# EasyEDA schematic SCH - RC2014- Dev V1.1 - freeroute.json

## Sheets
1 SCH - RC2014 - Teletext Dev V1.0: TITLE: ZX TTX2000 DEVELOPMENT BOARD - CPLD; REV: V1.0; Date: 07-09-2024; Sheet: 1/2
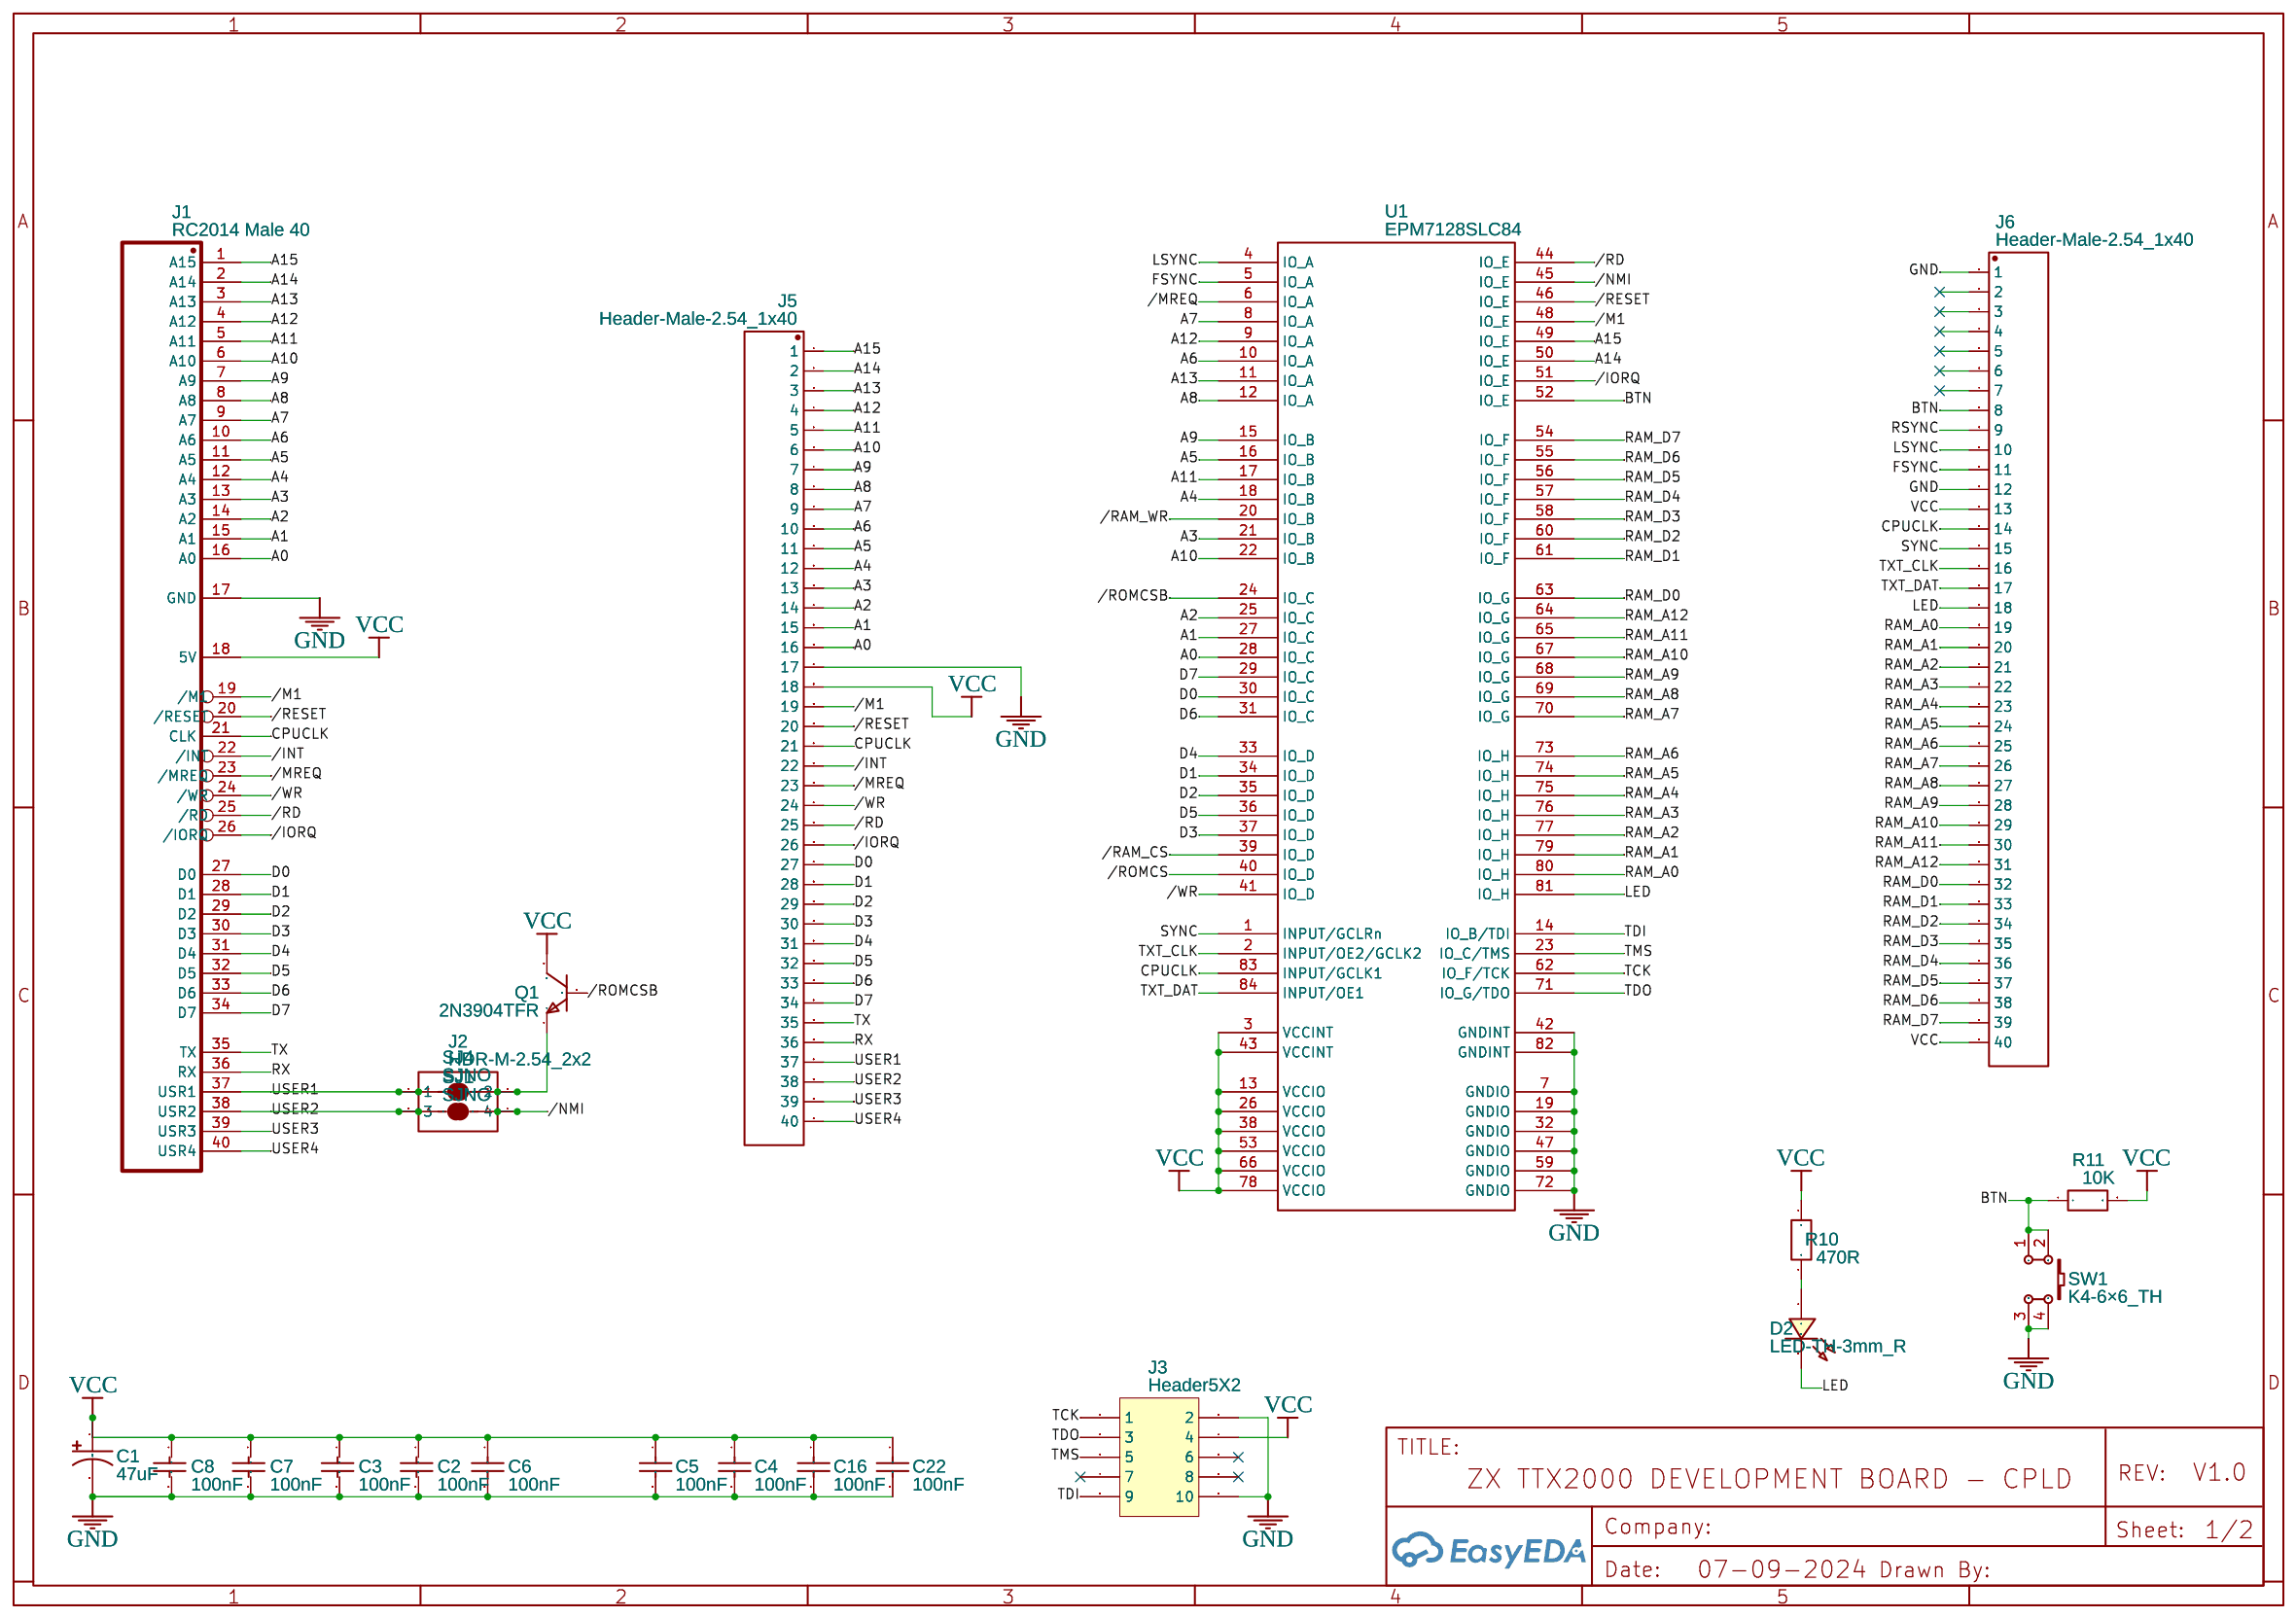
[diagram p0: SCH - RC2014 - Teletext Dev V1.0]
2 SCH - ROM & RAM: Sheet: 2/2
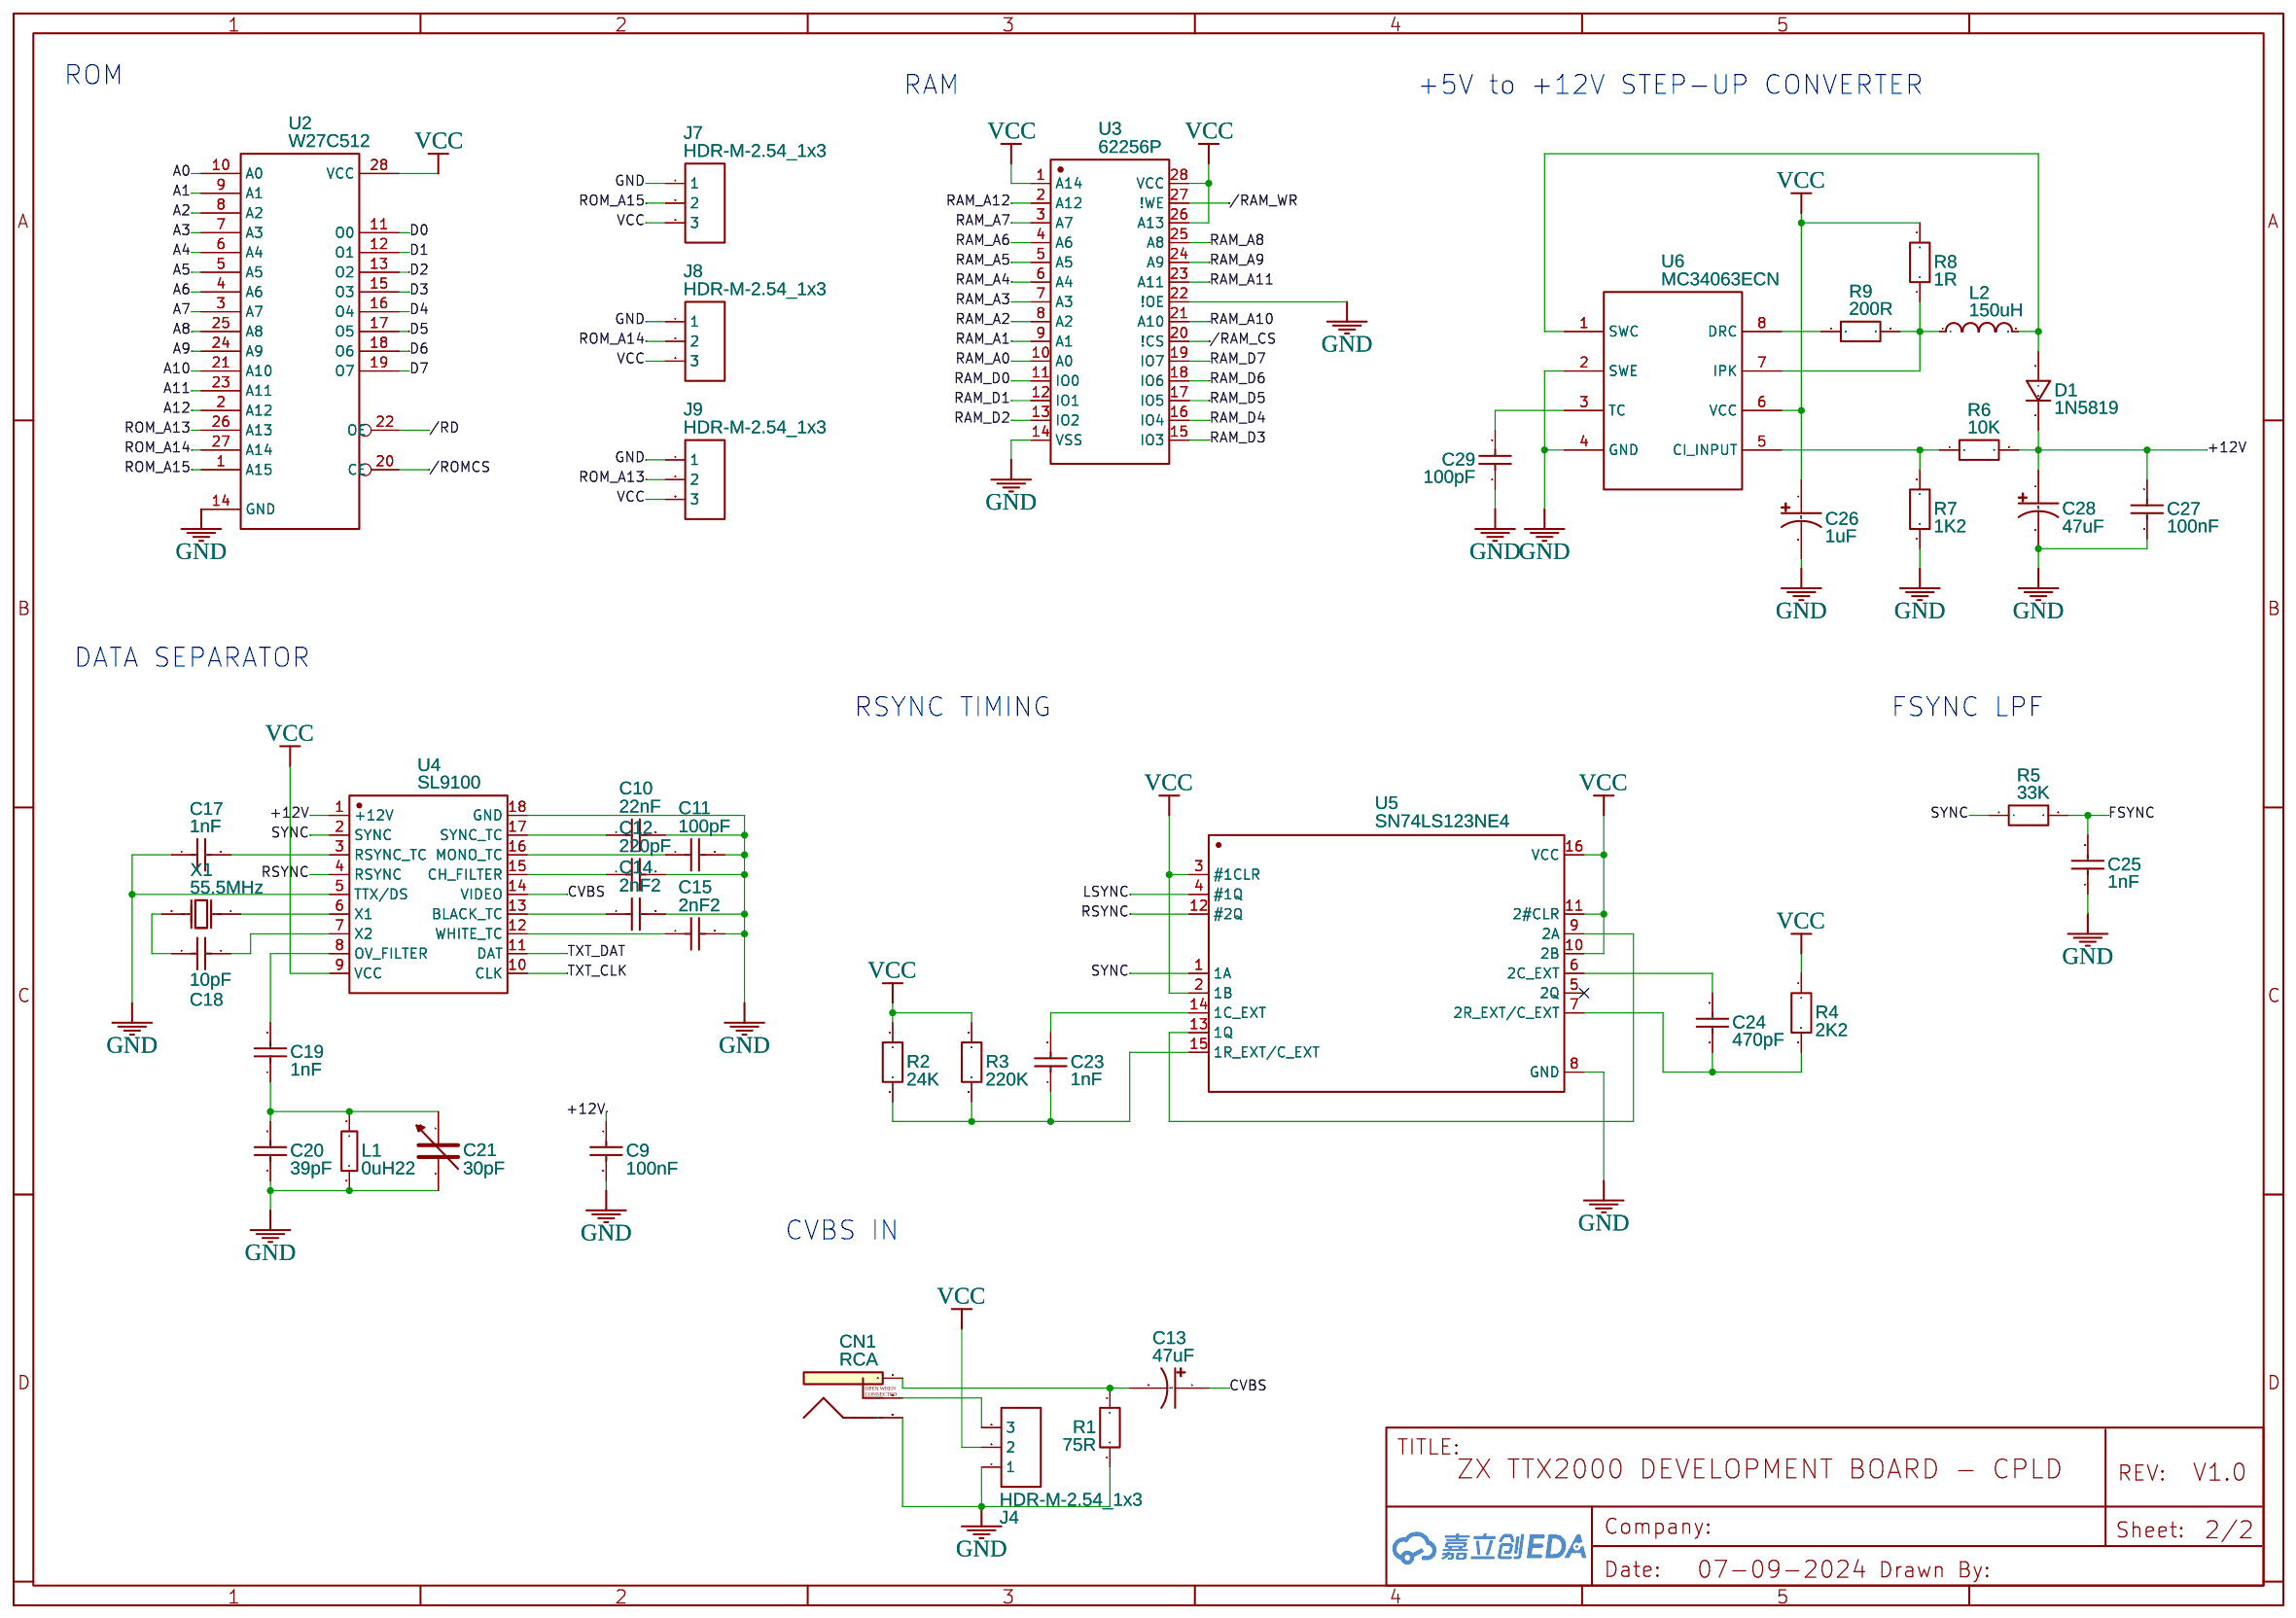
[diagram p1: SCH - ROM & RAM]
3 Fixes: TITLE: Fixes to be incorporated in V1.1; REV: 1.0; Date: 2024-10-29; Sheet: 1/1
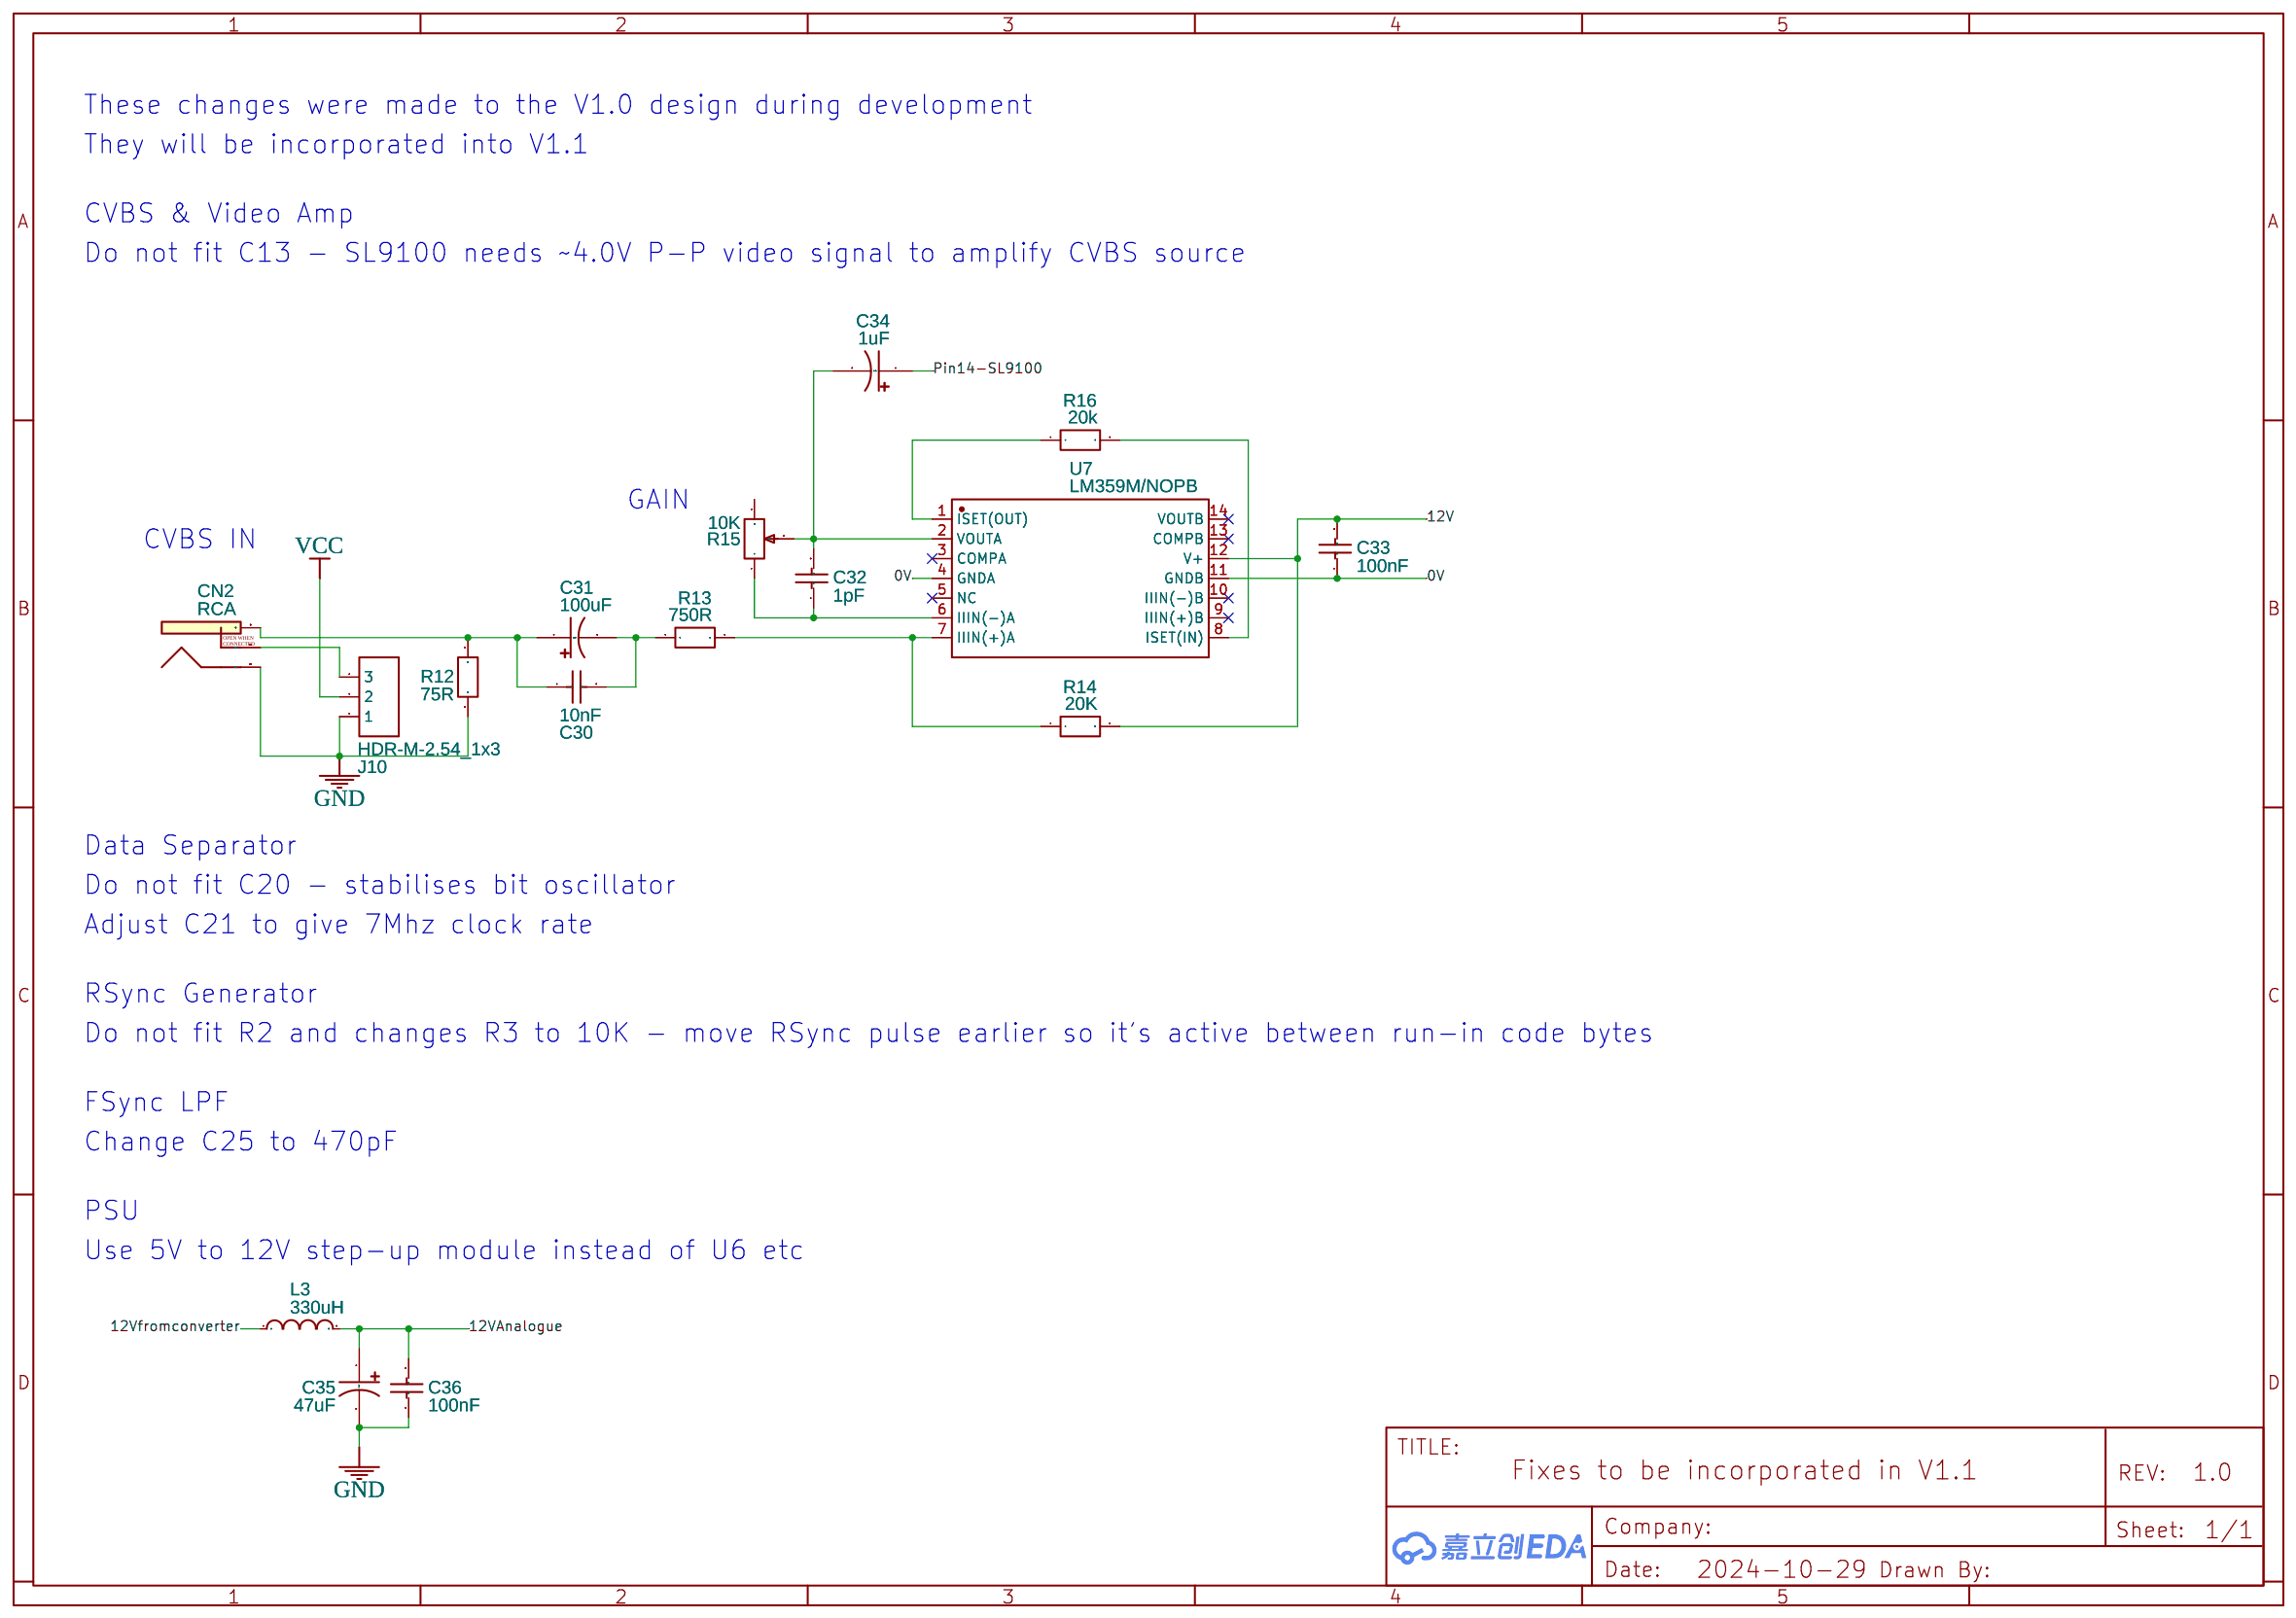
[diagram p2: Fixes]

## Parts
sheet Fixes
C30  10nF  [CAP-TH_L5.5-W3.5-P2.50-D0.5 COPY]
C31  100uF  [CAP-TH_BD6.3-P2.50-D1.0-FD]
C32  1pF  [CAP-TH_L5.5-W3.5-P2.50-D0.5 COPY]
C33  100nF  [CAP-TH_L5.5-W3.5-P2.50-D0.5 COPY]
C34  1uF  [CAP-TH_BD6.3-P2.50-D1.0-FD]
C35  47uF  [CAP-TH_BD6.3-P2.50-D1.0-FD]
C36  100nF  [CAP-TH_L5.5-W3.5-P2.50-D0.5 COPY]
CN2  RCA  [RCA]
J10  HDR-M-2.54_1x3  [HDR-M-2.54_1X3]
L3  330uH  [INDUCTOR_330UH_P5.0]
R12  75R  [R_AXIAL-0.3]
R13  750R  [R_AXIAL-0.3]
R14  20K  [R_AXIAL-0.3]
R15  10K  [RES-ADJ-TH_EVND8AA]
R16  20k  [R_AXIAL-0.3]
U7  LM359M/NOPB  [SOIC-14_L8.7-W3.9-P1.27-LS6.0-BL]
sheet SCH - RC2014 - Teletext Dev V1.0
C1  47uF  [CAP-TH_BD6.3-P2.50-D1.0-FD]
C2  100nF  [CAP-TH_L5.5-W3.5-P2.50-D0.5 COPY]
C3  100nF  [CAP-TH_L5.5-W3.5-P2.50-D0.5 COPY]
C4  100nF  [CAP-TH_L5.5-W3.5-P2.50-D0.5 COPY]
C5  100nF  [CAP-TH_L5.5-W3.5-P2.50-D0.5 COPY]
C6  100nF  [CAP-TH_L5.5-W3.5-P2.50-D0.5 COPY]
C7  100nF  [CAP-TH_L5.5-W3.5-P2.50-D0.5 COPY]
C8  100nF  [CAP-TH_L5.5-W3.5-P2.50-D0.5 COPY]
C16  100nF  [CAP-TH_L5.5-W3.5-P2.50-D0.5 COPY]
C22  100nF  [CAP-TH_L5.5-W3.5-P2.50-D0.5 COPY]
D2  LED-TH-3mm_R  [LED-TH_BD3.0_RED]
J1  RC2014 Male 40  [HDR-1X40-A-M-R-2.54MM]
J2  HDR-M-2.54_2x2  [HDR-M-2.54_2X2]
J3  Header5X2  [HDR-M-2.54_2X5]
J5  Header-Male-2.54_1x40  [HDR-TH_40P-P2.54-V-M-1]
J6  Header-Male-2.54_1x40  [HDR-TH_40P-P2.54-V-M-1]
Q1  2N3904TFR  [TO-92-3_L4.8-W3.7-P2.54-L]
R10  470R  [R_AXIAL-0.3]
R11  10K  [R_AXIAL-0.3]
SJ1  SJNO  [SJ_2S-NO]
SJ4  SJNO  [SJ_2S-NO]
SW1  K4-6×6_TH  [KEY-TH_4P-L6.0-W6.0-P4.50-LS6.5]
U1  EPM7128SLC84  [PLCC84_PTH-SKT]
sheet SCH - ROM & RAM
C9  100nF  [CAP-TH_L5.5-W3.5-P2.50-D0.5 COPY]
C10  22nF  [CAP-TH_L5.5-W3.5-P2.50-D0.5 COPY]
C11  100pF  [CAP-TH_L5.5-W3.5-P2.50-D0.5 COPY]
C12  220pF  [CAP-TH_L5.5-W3.5-P2.50-D0.5 COPY]
C13  47uF  [CAP-TH_BD6.3-P2.50-D1.0-FD]
C14  2nF2  [CAP-TH_L5.5-W3.5-P2.50-D0.5 COPY]
C15  2nF2  [CAP-TH_L5.5-W3.5-P2.50-D0.5 COPY]
C17  1nF  [CAP-TH_L5.5-W3.5-P2.50-D0.5 COPY]
C18  10pF  [CAP-TH_L5.5-W3.5-P2.50-D0.5 COPY]
C19  1nF  [CAP-TH_L5.5-W3.5-P2.50-D0.5 COPY]
C20  39pF  [CAP-TH_L5.5-W3.5-P2.50-D0.5 COPY]
C21  30pF  [CAPACITOR VARIABLE TRIMMER]
C23  1nF  [CAP-TH_L5.5-W3.5-P2.50-D0.5 COPY]
C24  470pF  [CAP-TH_L5.5-W3.5-P2.50-D0.5 COPY]
C25  1nF  [CAP-TH_L5.5-W3.5-P2.50-D0.5 COPY]
C26  1uF  [CAP-TH_BD6.3-P2.50-D1.0-FD]
C27  100nF  [CAP-TH_L5.5-W3.5-P2.50-D0.5 COPY]
C28  47uF  [CAP-TH_BD6.3-P2.50-D1.0-FD]
C29  100pF  [CAP-TH_L5.5-W3.5-P2.50-D0.5 COPY]
CN1  RCA  [RCA]
D1  1N5819  [DO-41_BD2.4-L4.7-P8.70-D0.9-RD]
J4  HDR-M-2.54_1x3  [HDR-M-2.54_1X3]
J7  HDR-M-2.54_1x3  [HDR-M-2.54_1X3]
J8  HDR-M-2.54_1x3  [HDR-M-2.54_1X3]
J9  HDR-M-2.54_1x3  [HDR-M-2.54_1X3]
L1  0uH22  [RES-TH_BD2.2-L6.0-P10.00-D0.5]
L2  150uH  [IND-TH_BD7.8-P5.00-D0.7]
R1  75R  [R_AXIAL-0.3]
R2  24K  [R_AXIAL-0.3]
R3  220K  [R_AXIAL-0.3]
R4  2K2  [R_AXIAL-0.3]
R5  33K  [R_AXIAL-0.3]
R6  10K  [R_AXIAL-0.3]
R7  1K2  [R_AXIAL-0.3]
R8  1R  [R_AXIAL-0.3]
R9  200R  [R_AXIAL-0.3]
U2  W27C512  [DIP28-600 APC]
U3  62256P  [DIP28-600]
U4  SL9100  [DIP-18_L21.8-W6.4-P2.54-LS7.6-BL]
U5  SN74LS123NE4  [PDIP-16_L19.3-W6.4-P2.54-LS7.94-BL]
U6  MC34063ECN  [DIP-8_L9.8-W6.6-P2.54-LS7.6-BL]
X1  55.5MHz  [OSC-TH_L10.0-W4.5-P5.00]

## Library data of the parts
C2-C12 C14-C20 C22-C25 C27 C29 C30 C32 C33 C36 = 100nF (104) ±20% 100V: Supplier: LCSC; Manufacturer: ReliaPro; Supplier Part: C72322
C1 C13 C26 C28 C31 C34 C35 = KM1H470ME110A00CV0: Supplier: LCSC; Supplier Part: C190654; Manufacturer: Changzhou Huawei Elec; Contributor: LCSC; JLCPCB Part Class: Extended Part
CN1 CN2 = RCA: Contributor: SparkFun
J4 J7-J10 = HDR-M-2.54_1x3: Supplier Part: C180248; Supplier: LCSC; Contributor: LCEDA_Lib
L3 = INDUCTOR_330UH_P5.0: Contributor: Deepak Sahu; Supplier: LCSC; Supplier Part: C329820; Manufacturer: chilisin(奇力新); JLCPCB Part Class: Extended Part
R1-R14 R16 = R_AXIAL-0.3_EU: Contributor: LCEDA_Lib
R15 = EVND8AA03B24: Supplier: LCSC; Manufacturer: PANASONIC; Resistance(Ohms): 20K; Contributor: LCSC; Supplier Part: C5017; Resistance (Ohms): 20K
U7 = LM359M/NOPB: Contributor: LCSC; Supplier: LCSC; Supplier Part: C1346280; Manufacturer: TI(德州仪器); JLCPCB Part Class: Extended Part
D2 = LED-TH-3mm_R: Manufacturer: EVERLIGHT(台湾亿光); Manufacturer Part: 204-10SDRD/S530-A3-L; Supplier Part: C84774; Supplier: LCSC; Contributor: LCEDA_Lib
J1 = RC2014 Male 40
J2 = HDR-M-2.54_2x2: Supplier Part: C66690; Supplier: LCSC; Contributor: LCEDA_Lib
J3 = Header5X2: Supplier Part: S9169-ND; Supplier: Digi-Key; Manufacturer: Sullins; Manufacturer Part: SBH11-PBPC-D05-ST-BK; Contributor: Min Lan
J5 J6 = Header-Male-2.54_1x40: Supplier: LCSC; Manufacturer: BOOMELE; Manufacturer Part: 2.54mm 1x40P; Supplier Part: C2337; JLCPCB Part Class: Extended Part
Q1 = 2N3904TFR: Supplier: LCSC; Supplier Part: C258185; Manufacturer: ON Semicon; Contributor: LCSC; JLCPCB Part Class: Extended Part
SJ1 SJ4 = SOLDERJUMPERNO: Solder Jumper; Contributor: SparkFun
SW1 = K4-6×6_TH: Supplier: LCSC; Supplier Part: C136684; Manufacturer: 韩国韩荣; Manufacturer Part: K2-1102DP-E4SW-04; Contributor: LCEDA_Lib
U1 = EPM7128SLC84: Supplier Part: 692-Z8S18020VEG; Supplier: Mouser; link: http://www.mouser.com/ds/2/450/z8s180ps-28828.pdf; Contributor: cocus
C21 = variable capacitor trimmer: Contributor: Rakhmat Varis; license: https://www.gnu.org/licenses/lgpl-2.1.html
D1 = 1N4001-T: Contributor: LCSC; Supplier: LCSC; Supplier Part: C99656; Manufacturer: DIODES(美台); JLCPCB Part Class: Extended Part
L1 = AXIAL-0.4: Contributor: lcsc; Supplier: LCSC; Supplier Part: C9900020985; Manufacturer: null; JLCPCB Part Class: Extended Part
L2 = RCH8011NP-181L: Contributor: lcsc; Supplier: LCSC; Supplier Part: C2639165; Manufacturer: Sumida(胜美达); JLCPCB Part Class: Extended Part
U2 = W27C512: Contributor: BoroniusEDA; Package Display: No
U3 = 62256P
U4 = TMS4464: Contributor: Swansby
U5 = SN74LS123NE4: Supplier: LCSC; Supplier Part: C20345753; Manufacturer: TI(德州仪器); Contributor: lcsc
U6 = MC34063ECN: Supplier: LCSC; Manufacturer: ST(意法半导体); Supplier Part: C5180; JLCPCB Part Class: Extended Part
X1 = X49UD3MSD2SC: Supplier: LCSC; Manufacturer: YXC; Supplier Part: C11252

## Nets
0V: C33.1 U7.4(GNDA) U7.11(GNDB)
12V: C33.2 R14.2 U7.12(V+)
12VAnalogue: C35.1 C36.2 L3.2
12Vfromconverter: L3.1
+12V: C9.1 C27.2 C28.1 D1.1(C) R6.2 U4.1(+12V)
GND: C1.2 C2.2 C3.2 C4.2 C5.2 C6.2 C7.2 C8.2 C9.2 C10.2 C11.2 C12.2 C14.2 C15.2 C16.2 C17.1 C20.1 C21.2 C22.2 C25.1 C26.2 C27.1 C28.2 C29.1 C35.2 C36.1 CN1.SHELL CN2.SHELL J1.17(GND) J3.2 J3.10 J4.1 J5.17 J6.1 J6.12 J7.1 J8.1 J9.1 J10.1 L1.1 R1.2 R7.1 R12.2 SW1.3 SW1.4 U1.7(GNDIO) U1.19(GNDIO) U1.32(GNDIO) U1.42(GNDINT) U1.47(GNDIO) U1.59(GNDIO) U1.72(GNDIO) U1.82(GNDINT) U2.14(GND) U3.14(VSS) U3.22(!OE) U4.5(TTX/DS) U4.18(GND) U5.8(GND) U6.2(SWE) U6.4(GND)
VCC: C1.1 C2.1 C3.1 C4.1 C5.1 C6.1 C7.1 C8.1 C16.1 C22.1 C26.1 J1.18(5V) J3.4 J4.2 J5.18 J6.13 J6.40 J7.3 J8.3 J9.3 J10.2 Q1.3(C) R2.1 R3.1 R4.1 R8.2 R10.1 R11.2 U1.3(VCCINT) U1.13(VCCIO) U1.26(VCCIO) U1.38(VCCIO) U1.43(VCCINT) U1.53(VCCIO) U1.66(VCCIO) U1.78(VCCIO) U2.28(VCC) U3.1(A14) U3.26(A13) U3.28(VCC) U4.9(VCC) U5.2(1B) U5.3(#1CLR) U5.10(2B) U5.11(2#CLR) U5.16(VCC) U6.6(VCC)
/INT: J1.22(/INT) J5.22
/IORQ: J1.26(/IORQ) J5.26 U1.51(IO E)
/M1: J1.19(/M1) J5.19 U1.48(IO E)
/MREQ: J1.23(/MREQ) J5.23 U1.6(IO A)
/NMI: J2.4 SJ1.2 U1.45(IO E)
/RAM_CS: U1.39(IO D) U3.20(!CS)
/RAM_WR: U1.20(IO B) U3.27(!WE)
/RD: J1.25(/RD) J5.25 U1.44(IO E) U2.22(OE)
/RESET: J1.20(/RESET) J5.20 U1.46(IO E)
/ROMCS: U1.40(IO D) U2.20(CE)
/ROMCSB: Q1.2(B) U1.24(IO C)
/WR: J1.24(/WR) J5.24 U1.41(IO D)
A0: J1.16(A0) J5.16 U1.28(IO C) U2.10(A0)
A1: J1.15(A1) J5.15 U1.27(IO C) U2.9(A1)
A2: J1.14(A2) J5.14 U1.25(IO C) U2.8(A2)
A3: J1.13(A3) J5.13 U1.21(IO B) U2.7(A3)
A4: J1.12(A4) J5.12 U1.18(IO B) U2.6(A4)
A5: J1.11(A5) J5.11 U1.16(IO B) U2.5(A5)
A6: J1.10(A6) J5.10 U1.10(IO A) U2.4(A6)
A7: J1.9(A7) J5.9 U1.8(IO A) U2.3(A7)
A8: J1.8(A8) J5.8 U1.12(IO A) U2.25(A8)
A9: J1.7(A9) J5.7 U1.15(IO B) U2.24(A9)
A10: J1.6(A10) J5.6 U1.22(IO B) U2.21(A10)
A11: J1.5(A11) J5.5 U1.17(IO B) U2.23(A11)
A12: J1.4(A12) J5.4 U1.9(IO A) U2.2(A12)
A13: J1.3(A13) J5.3 U1.11(IO A)
A14: J1.2(A14) J5.2 U1.50(IO E)
A15: J1.1(A15) J5.1 U1.49(IO E)
BTN: J6.8 R11.1 SW1.1 SW1.2 U1.52(IO E)
CPUCLK: J1.21(CLK) J5.21 J6.14 U1.83(INPUT/GCLK1)
CVBS: C13.1 U4.14(VIDEO)
D0: J1.27(D0) J5.27 U1.30(IO C) U2.11(O0)
D1: J1.28(D1) J5.28 U1.34(IO D) U2.12(O1)
D2: J1.29(D2) J5.29 U1.35(IO D) U2.13(O2)
D3: J1.30(D3) J5.30 U1.37(IO D) U2.15(O3)
D4: J1.31(D4) J5.31 U1.33(IO D) U2.16(O4)
D5: J1.32(D5) J5.32 U1.36(IO D) U2.17(O5)
D6: J1.33(D6) J5.33 U1.31(IO C) U2.18(O6)
D7: J1.34(D7) J5.34 U1.29(IO C) U2.19(O7)
FSYNC: C25.2 J6.11 R5.2 U1.5(IO A)
LED: D2.2 J6.18 U1.81(IO H)
LSYNC: J6.10 U1.4(IO A) U5.4(#1Q)
Pin14-SL9100: C34.1
RAM_A0: J6.19 U1.80(IO H) U3.10(A0)
RAM_A1: J6.20 U1.79(IO H) U3.9(A1)
RAM_A2: J6.21 U1.77(IO H) U3.8(A2)
RAM_A3: J6.22 U1.76(IO H) U3.7(A3)
RAM_A4: J6.23 U1.75(IO H) U3.6(A4)
RAM_A5: J6.24 U1.74(IO H) U3.5(A5)
RAM_A6: J6.25 U1.73(IO H) U3.4(A6)
RAM_A7: J6.26 U1.70(IO G) U3.3(A7)
RAM_A8: J6.27 U1.69(IO G) U3.25(A8)
RAM_A9: J6.28 U1.68(IO G) U3.24(A9)
RAM_A10: J6.29 U1.67(IO G) U3.21(A10)
RAM_A11: J6.30 U1.65(IO G) U3.23(A11)
RAM_A12: J6.31 U1.64(IO G) U3.2(A12)
RAM_D0: J6.32 U1.63(IO G) U3.11(IO0)
RAM_D1: J6.33 U1.61(IO F) U3.12(IO1)
RAM_D2: J6.34 U1.60(IO F) U3.13(IO2)
RAM_D3: J6.35 U1.58(IO F) U3.15(IO3)
RAM_D4: J6.36 U1.57(IO F) U3.16(IO4)
RAM_D5: J6.37 U1.56(IO F) U3.17(IO5)
RAM_D6: J6.38 U1.55(IO F) U3.18(IO6)
RAM_D7: J6.39 U1.54(IO F) U3.19(IO7)
ROM_A13: J9.2 U2.26(A13)
ROM_A14: J8.2 U2.27(A14)
ROM_A15: J7.2 U2.1(A15)
RSYNC: J6.9 U4.4(RSYNC) U5.12(#2Q)
RX: J1.36(RX) J5.36
SYNC: J6.15 R5.1 U1.1(INPUT/GCLRn) U4.2(SYNC) U5.1(1A)
TCK: J3.1 U1.62(IO F/TCK)
TDI: J3.9 U1.14(IO B/TDI)
TDO: J3.3 U1.71(IO G/TDO)
TMS: J3.5 U1.23(IO C/TMS)
TX: J1.35(TX) J5.35
TXT_CLK: J6.16 U1.2(INPUT/OE2/GCLK2) U4.10(CLK)
TXT_DAT: J6.17 U1.84(INPUT/OE1) U4.11(DAT)
USER1: J1.37(USR1) J2.1 J5.37 SJ4.1
USER2: J1.38(USR2) J2.3 J5.38 SJ1.1
USER3: J1.39(USR3) J5.39
USER4: J1.40(USR4) J5.40
Net-(C10-1): C10.1 U4.17(SYNC TC)
Net-(C11-1): C11.1 U4.16(MONO TC)
Net-(C12-1): C12.1 U4.15(CH FILTER)
Net-(C13-2): C13.2 CN1.PIN R1.1
Net-(C14-1): C14.1 U4.13(BLACK TC)
Net-(C15-1): C15.1 U4.12(WHITE TC)
Net-(C17-2): C17.2 U4.3(RSYNC TC)
Net-(C18-1): C18.1 X1.2(OSC2)
Net-(C18-2): C18.2 U4.7(X2)
Net-(C19-1): C19.1 C20.2 C21.1 L1.2
Net-(C19-2): C19.2 U4.8(OV FILTER)
Net-(C23-1): C23.1 R2.2 R3.2 U5.15(1R_EXT/C_EXT)
Net-(C23-2): C23.2 U5.14(1C_EXT)
Net-(C24-1): C24.1 R4.2 U5.7(2R_EXT/C_EXT)
Net-(C24-2): C24.2 U5.6(2C_EXT)
Net-(C29-2): C29.2 U6.3(TC)
Net-(C30-1): C30.1 C31.1 CN2.PIN R12.1
Net-(C30-2): C30.2 C31.2 R13.1
Net-(C32-1): C32.1 R15.1 U7.6(IIIN(-)A)
Net-(C32-2): C32.2 C34.2 R15.2 U7.2(VOUTA)
Net-(CN1-SWITCH): CN1.SWITCH J4.3
Net-(CN2-SWITCH): CN2.SWITCH J10.3
Net-(D1-2): D1.2(A) L2.2 U6.1(SWC)
Net-(D2-1): D2.1 R10.2
Net-(J2-2): J2.2 Q1.1(E) SJ4.2
Net-(L2-1): L2.1 R8.1 R9.2 U6.7(IPK)
Net-(R6-1): R6.1 R7.2 U6.5(CI INPUT)
Net-(R9-1): R9.1 U6.8(DRC)
Net-(R13-2): R13.2 R14.1 U7.7(IIIN(+)A)
Net-(R16-1): R16.1 U7.1(ISET(OUT))
Net-(R16-2): R16.2 U7.8(ISET(IN))
Net-(U4-6): U4.6(X1) X1.1(OSC1)
Net-(U5-9): U5.9(2A) U5.13(1Q)

Not connected (* = marked no-connect by the designer): J3 6* 7* 8*; J6 2 3 4 5 6 7; R15 3; U5 5(2Q)*; U7 3(COMPA)* 5(NC)* 9(IIIN(+)B)* 10(IIIN(-)B)* 13(COMPB)* 14(VOUTB)*

## Notes on the sheets
sheet 2
- ROM
- RAM
- +5V to +12V STEP-UP CONVERTER
- DATA SEPARATOR
- RSYNC TIMING
- FSYNC LPF
- CVBS IN
sheet 3
- These changes were made to the V1.0 design during development
- They will be incorporated into V1.1
- CVBS & Video Amp
- Do not fit C13 - SL9100 needs ~4.0V P-P video signal to amplify CVBS source
- GAIN
- CVBS IN
- Data Separator
- Do not fit C20 - stabilises bit oscillator
- Adjust C21 to give 7Mhz clock rate
- RSync Generator
- Do not fit R2 and changes R3 to 10K - move RSync pulse earlier so it's active between run-in code bytes
- FSync LPF
- Change C25 to 470pF
- PSU
- Use 5V to 12V step-up module instead of U6 etc
